# EAGLE board dac8_v2 (EAGLE 5.12)
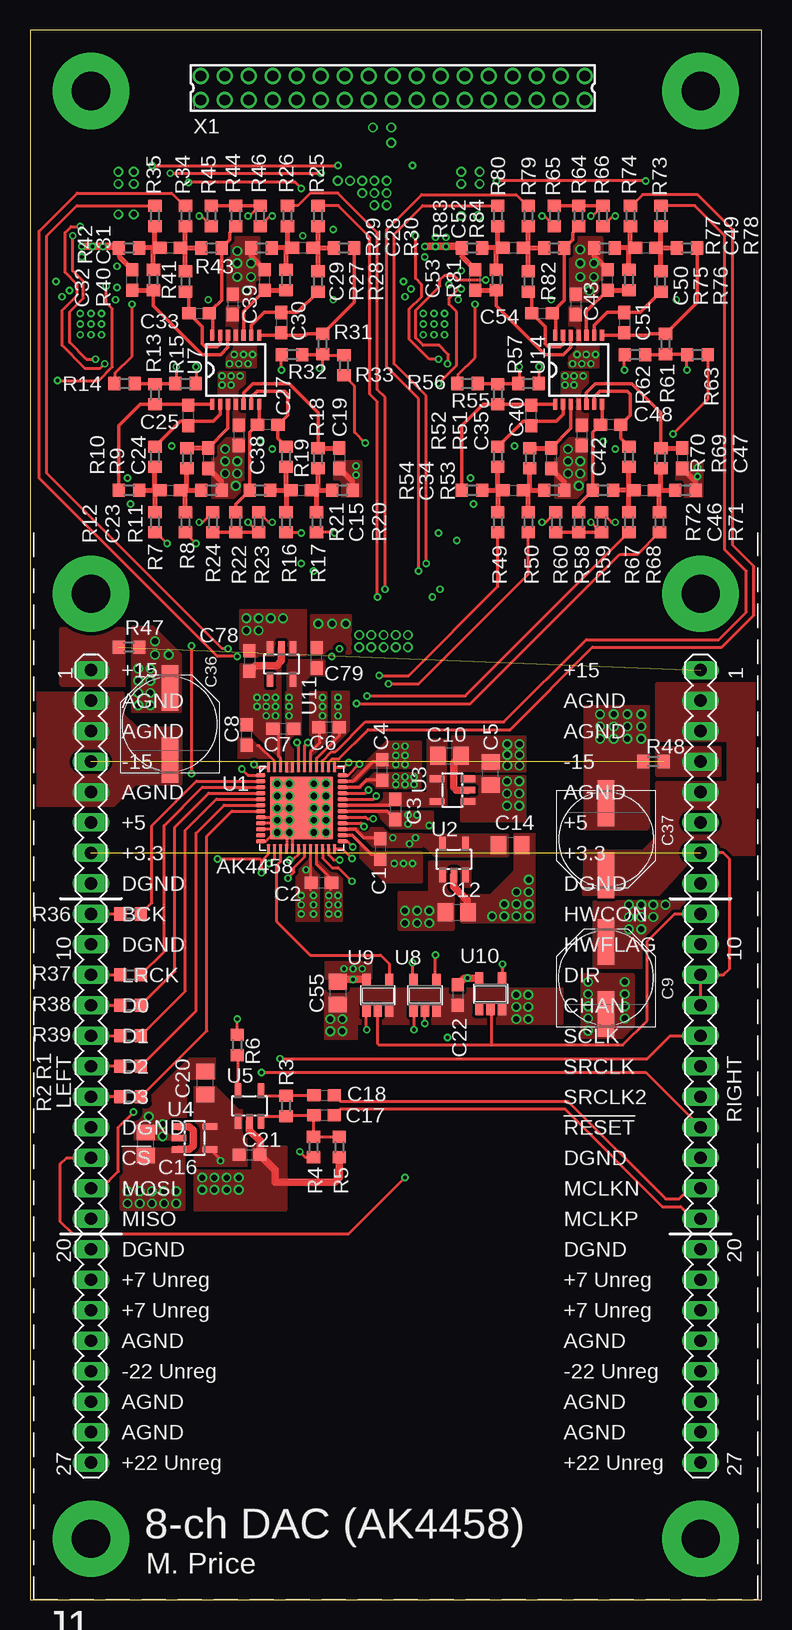
[diagram p2: board, top side]
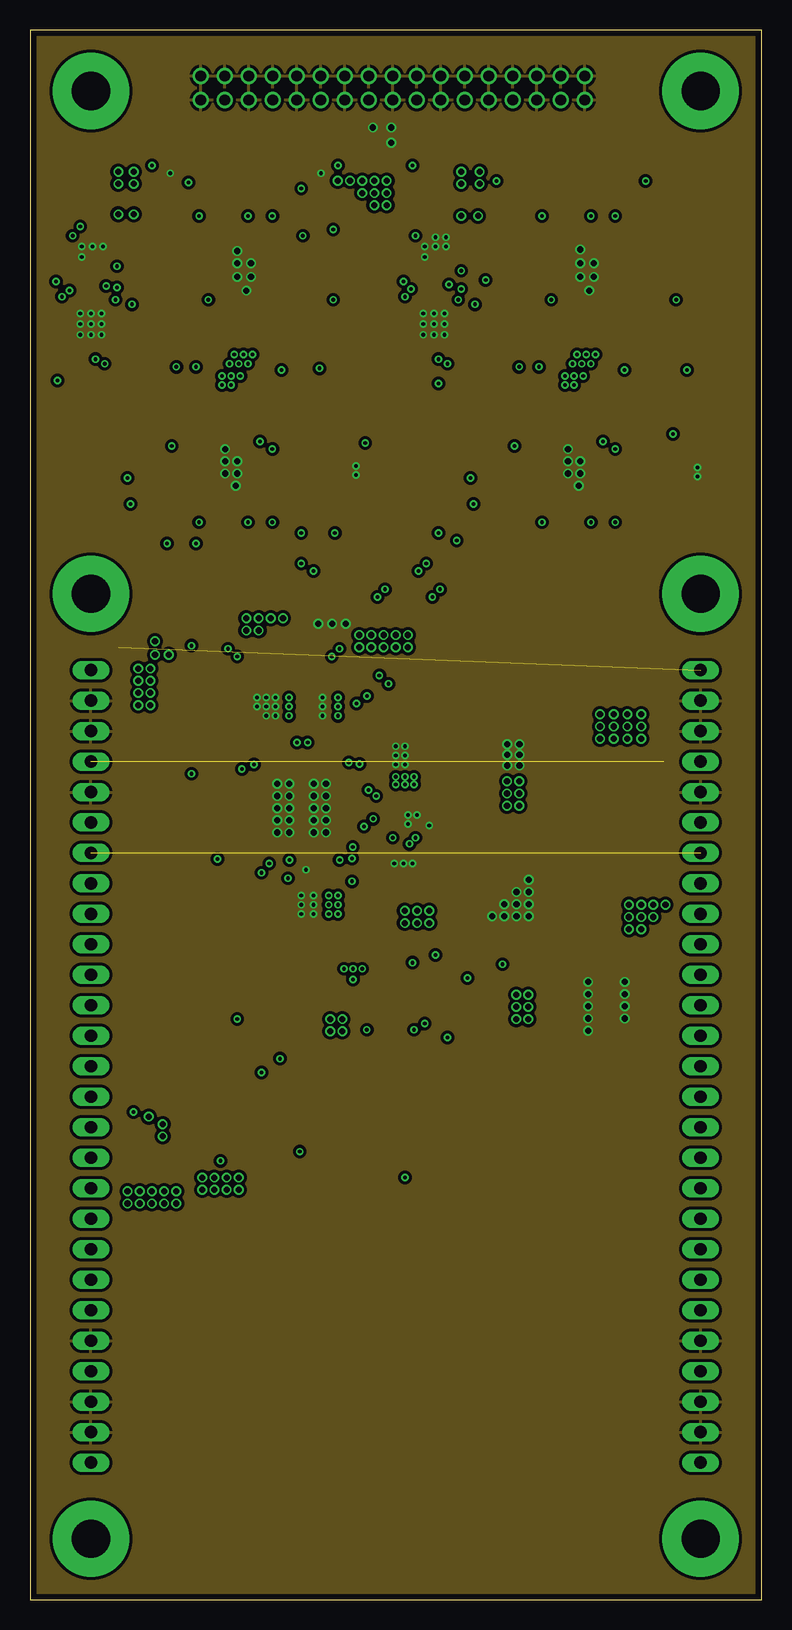
[diagram p3: board, inner layer Route2]
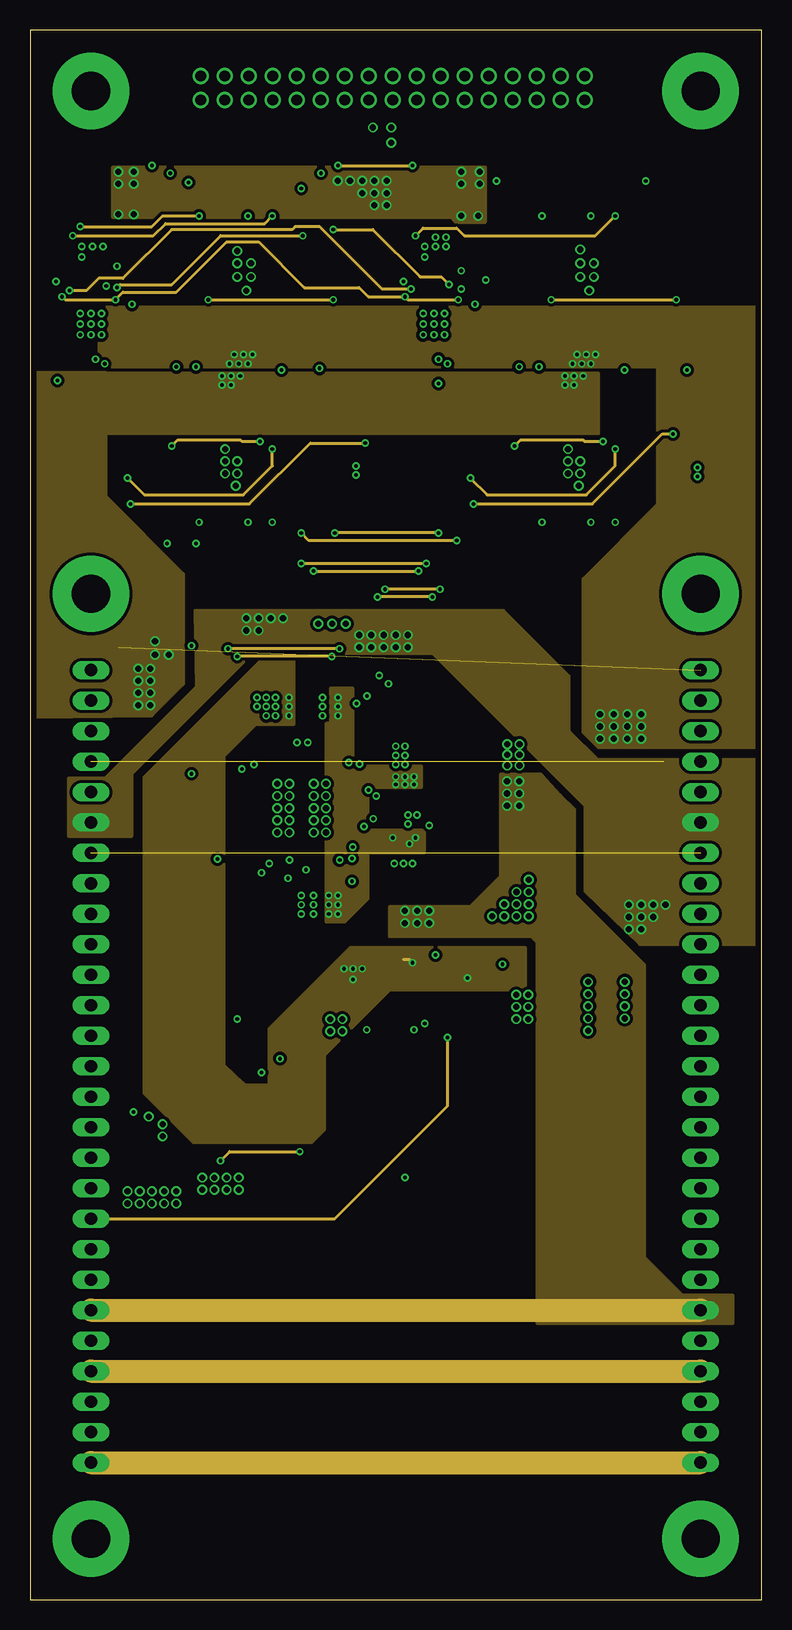
[diagram p4: board, inner layer Route15]
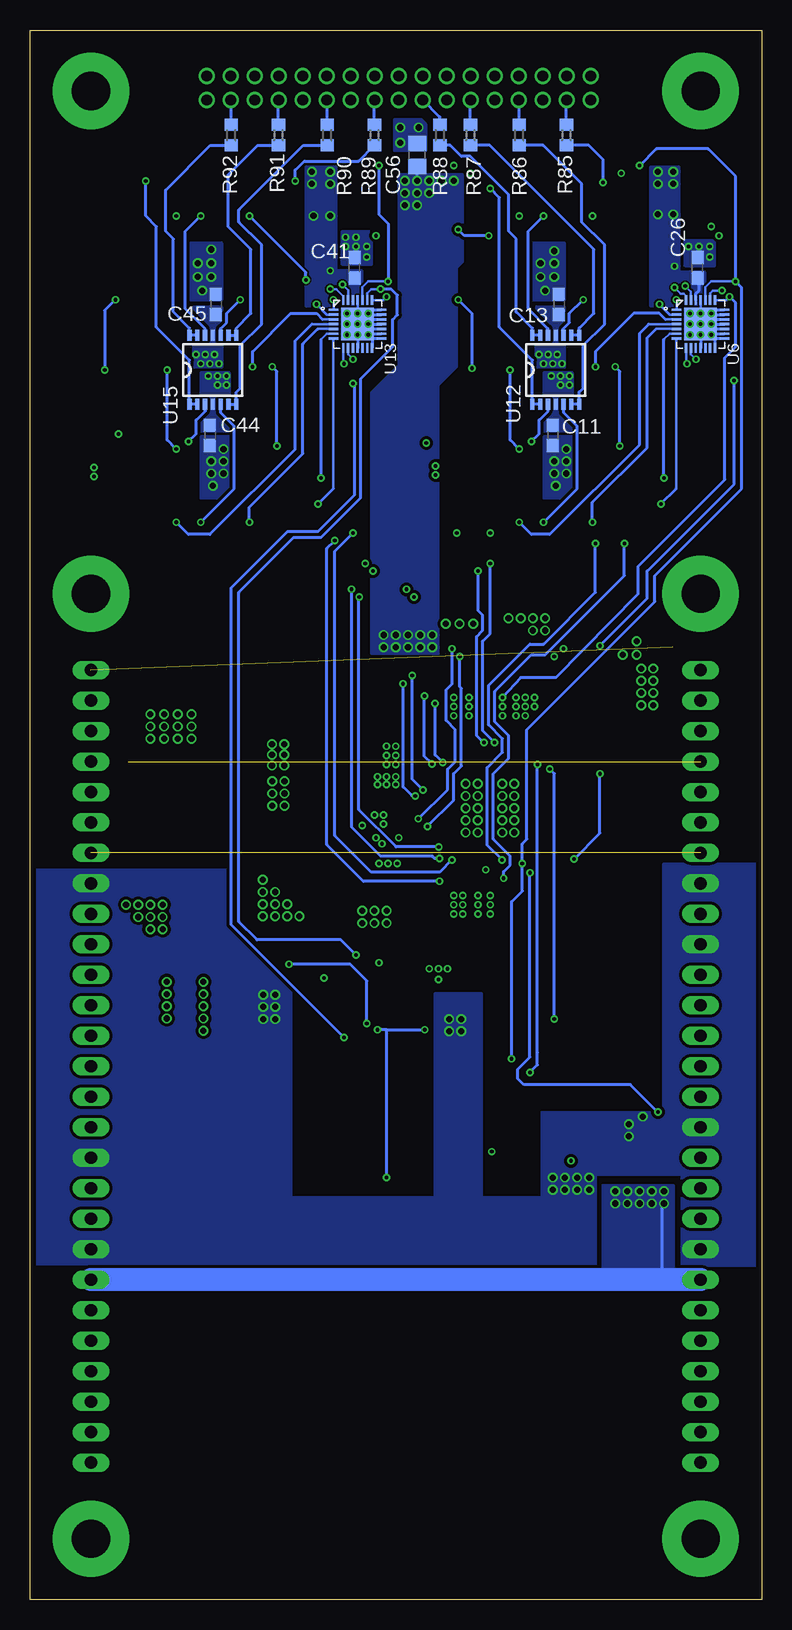
[diagram p5: board, bottom side, seen from below]

Size 60.96 x 130.81 mm. Coordinates in mm from the lower left corner, seen from the top.
Outline: 60.96,130.81 0,130.81 0,0 60.96,0 60.96,130.81
Copper layers (1*2*15*16): Top 0.035mm / dielectric 0.2mm / Route2 0.035mm / dielectric 1.2mm / Route15 0.035mm / dielectric 0.2mm / Bottom 0.035mm
Design rules "Elecrow_4-layer_PCB_eagle_rule": minimum track width 6mil, minimum drill 12mil, track to track 6mil, track to pad 6mil, pad to pad 6mil, via to via 8mil, smd to smd 0mil, copper to edge 20mil, drill to drill 10mil, minimum pad ring 6mil, minimum via ring 6mil, stop-mask expansion 0mil, vias tented up to drill 100mil, thermal gap 10mil

## Footprints (pad centres in the part's own frame; a part is rotated, then mirrored left to right if it is on the bottom)
C0603 = smd 1.1 x 1: 1 -0.85,0; 2 0.85,0
C0805 = smd 1.3 x 1.5: 1 -0.95,0; 2 0.95,0
PANASONIC_E = smd 3.8 x 1.4: + 3,0; - -3,0
MOD-V2 = drill 1.016 long: 1L -25.4,33.02; 1R 25.4,33.02; 2L -25.4,30.48; 2R 25.4,30.48; 3L -25.4,27.94; 3R 25.4,27.94; 4L -25.4,25.4; 4R 25.4,25.4; 5L -25.4,22.86; 5R 25.4,22.86; 6L -25.4,20.32; 6R 25.4,20.32; 7L -25.4,17.78; 7R 25.4,17.78; 8L -25.4,15.24; 8R 25.4,15.24; 9L -25.4,12.7; 9R 25.4,12.7; 10L -25.4,10.16; 10R 25.4,10.16; 11L -25.4,7.62; 11R 25.4,7.62; 12L -25.4,5.08; 12R 25.4,5.08; 13L -25.4,2.54; 13R 25.4,2.54; 14L -25.4,0; 14R 25.4,0; 15L -25.4,-2.54; 15R 25.4,-2.54; 16L -25.4,-5.08; 16R 25.4,-5.08; 17L -25.4,-7.62; 17R 25.4,-7.62; 18L -25.4,-10.16; 18R 25.4,-10.16; 19L -25.4,-12.7; 19R 25.4,-12.7; 20L -25.4,-15.24; 20R 25.4,-15.24; 21L -25.4,-17.78; 21R 25.4,-17.78; 22L -25.4,-20.32; 22R 25.4,-20.32; 23L -25.4,-22.86; 23R 25.4,-22.86; 24L -25.4,-25.4; 24R 25.4,-25.4; 25L -25.4,-27.94; 25R 25.4,-27.94; 26L -25.4,-30.48; 26R 25.4,-30.48; 27L -25.4,-33.02; 27R 25.4,-33.02 | drill 3.175 pad 6.35 round: DP1 -25.4,39.37; DP2 25.4,39.37; DP3 -25.4,-39.37; DP4 25.4,-39.37
R0603 = smd 1 x 1.1: 1 -0.85,0; 2 0.85,0
QFN48_EP_AKM = smd 0.8 x 0.3: 1 -3.4,2.75; 2 -3.4,2.25; 3 -3.4,1.75; 4 -3.4,1.25; 5 -3.4,0.75; 6 -3.4,0.25; 7 -3.4,-0.25; 8 -3.4,-0.75; 9 -3.4,-1.25; 10 -3.4,-1.75; 11 -3.4,-2.25; 12 -3.4,-2.75; 25 3.4,-2.75; 26 3.4,-2.25; 27 3.4,-1.75; 28 3.4,-1.25; 29 3.4,-0.75; 30 3.4,-0.25; 31 3.4,0.25; 32 3.4,0.75; 33 3.4,1.25; 34 3.4,1.75; 35 3.4,2.25; 36 3.4,2.75 | smd 0.3 x 0.8: 13 -2.75,-3.4; 14 -2.25,-3.4; 15 -1.75,-3.4; 16 -1.25,-3.4; 17 -0.75,-3.4; 18 -0.25,-3.4; 19 0.25,-3.4; 20 0.75,-3.4; 21 1.25,-3.4; 22 1.75,-3.4; 23 2.25,-3.4; 24 2.75,-3.4; 37 2.75,3.4; 38 2.25,3.4; 39 1.75,3.4; 40 1.25,3.4; 41 0.75,3.4; 42 0.25,3.4; 43 -0.25,3.4; 44 -0.75,3.4; 45 -1.25,3.4; 46 -1.75,3.4; 47 -2.25,3.4; 48 -2.75,3.4 | smd 5.2 x 5.2: EP 0,0
SOT23-DBV = smd 0.55 x 1.2: 1 -0.95,-1.3; 2 0,-1.3; 3 0.95,-1.3; 4 0.95,1.3; 5 -0.95,1.3
QFN28 = smd 0.2 x 0.8: 1 -1.2,-2; 2 -0.8,-2; 3 -0.4,-2; 4 0,-2; 5 0.4,-2; 6 0.8,-2; 7 1.2,-2; 15 1.2,2; 16 0.8,2; 17 0.4,2; 18 0,2; 19 -0.4,2; 20 -0.8,2; 21 -1.2,2 | smd 0.8 x 0.2: 8 2,-1.2; 9 2,-0.8; 10 2,-0.4; 11 2,0; 12 2,0.4; 13 2,0.8; 14 2,1.2; 22 -2,1.2; 23 -2,0.8; 24 -2,0.4; 25 -2,0; 26 -2,-0.4; 27 -2,-0.8; 28 -2,-1.2 | smd 2.7 x 2.7: EP 0,0
TSSOP14 = smd 0.9 x 0.35: 1 -2.875,1.95; 2 -2.875,1.3; 3 -2.875,0.65; 4 -2.875,0; 5 -2.875,-0.65; 6 -2.875,-1.3; 7 -2.875,-1.95; 8 2.875,-1.95; 9 2.875,-1.3; 10 2.875,-0.65; 11 2.875,0; 12 2.875,0.65; 13 2.875,1.3; 14 2.875,1.95
SOT23-5 = smd 0.69 x 0.99: 1 -0.95,-1.29; 2 0,-1.29; 3 0.95,-1.29; 4 0.95,1.3; 5 -0.95,1.3
87758-3416 = drill 0.9 pad 1.27 round: 1 -16,-1; 2 -16,1; 3 -14,-1; 4 -14,1; 5 -12,-1; 6 -12,1; 7 -10,-1; 8 -10,1; 9 -8,-1; 10 -8,1; 11 -6,-1; 12 -6,1; 13 -4,-1; 14 -4,1; 15 -2,-1; 16 -2,1; 17 0,-1; 18 0,1; 19 2,-1; 20 2,1; 21 4,-1; 22 4,1; 23 6,-1; 24 6,1; 25 8,-1; 26 8,1; 27 10,-1; 28 10,1; 29 12,-1; 30 12,1; 31 14,-1; 32 14,1; 33 16,-1; 34 16,1

## Placement (x,y rotation side)
C1  0.1u  [C0603]  29.18,62.56 270 top
C2  0.1u  [C0603]  24.28,59.74 180 top
C3  0.1u  [C0603]  30.45,65.86 270 top
C4  0.1u  [C0603]  29.36,69.14 90 top
C5  2.2u  [C0805]  38.38,68.86 90 top
C6  0.1u  [C0603]  24.92,72.69 180 top
C7  0.1u  [C0603]  21.11,72.57 180 top
C8  1u  [C0603]  18.06,72.06 90 top
C9  220u  [PANASONIC_E]  48.01,51.82 90 top
C10  2.2u  [C0805]  34.95,70.33 0 top
C11  0.1u  [C0603]  17.4,97.03 270 bottom
C12  2.2u  [C0805]  35.56,57.28 0 top
C13  0.1u  [C0603]  16.89,107.95 270 bottom
C14  2.2u  [C0805]  40.01,62.87 0 top
C15  3.9n  [C0603]  22.61,92.46 0 top
C16  2.2u  [C0805]  9.65,37.97 90 top
C17  10n  [C0603]  24.51,40.39 0 top
C18  10n  [C0603]  24.51,42.04 0 top
C19  470p  [C0603]  25.78,95.12 270 top
C20  2.2u  [C0805]  14.61,43.05 90 top
C21  0.1u  [C0603]  18.29,37.08 0 top
C22  0.1u  [C0603]  35.64,50.39 270 top
C23  3.9n  [C0603]  11.68,92.46 0 top
C24  470p  [C0603]  14.86,95.12 270 top
C25  470p  [C0603]  13.21,98.68 90 top
C26  0.1u  [C0603]  5.33,111 90 bottom
C27  470p  [C0603]  19.81,97.92 180 top
C28  3.9n  [C0603]  22.73,112.65 180 top
C29  470p  [C0603]  19.56,109.98 90 top
C30  470p  [C0603]  20.95,106.43 270 top
C31  3.9n  [C0603]  11.68,112.65 180 top
C32  470p  [C0603]  8.51,109.98 90 top
C33  470p  [C0603]  14.1,107.19 0 top
C34  3.9n  [C0603]  40.26,92.46 0 top
C35  470p  [C0603]  43.43,95.12 270 top
C36  100u  [PANASONIC_E]  11.66,72.97 90 top
C37  100u  [PANASONIC_E]  48.01,63.37 270 top
C38  0.1u  [C0603]  17.4,97.03 270 top
C39  0.1u  [C0603]  16.89,107.95 270 top
C40  470p  [C0603]  41.78,98.68 90 top
C41  0.1u  [C0603]  33.91,111 90 bottom
C42  0.1u  [C0603]  45.97,97.03 270 top
C43  0.1u  [C0603]  45.47,107.95 270 top
C44  0.1u  [C0603]  45.97,97.03 270 bottom
C45  0.1u  [C0603]  45.47,107.95 270 bottom
C46  3.9n  [C0603]  51.18,92.46 0 top
C47  470p  [C0603]  54.36,95.12 270 top
C48  470p  [C0603]  48.39,97.92 180 top
C49  3.9n  [C0603]  51.31,112.65 180 top
C50  470p  [C0603]  48.13,109.98 90 top
C51  470p  [C0603]  49.53,106.43 270 top
C52  3.9n  [C0603]  40.26,112.65 180 top
C53  470p  [C0603]  37.08,109.98 90 top
C54  470p  [C0603]  42.67,107.19 0 top
C55  2.2u  [C0805]  25.65,50.55 270 top
C56  2.2u  [C0805]  28.7,120.4 90 bottom
C78  1u  [C0603]  18.29,78.23 270 top
C79  1u  [C0603]  23.88,78.49 90 top
J1  MOD-V2  [MOD-V2]  30.48,44.45 0 top
R1  50  [R0603]  8.38,44.45 180 top
R2  50  [R0603]  8.38,41.91 180 top
R3  100  [R0603]  21.34,41.15 270 top
R4  10k  [R0603]  23.62,37.72 270 top
R5  10k  [R0603]  25.78,37.72 90 top
R6  22  [R0603]  17.27,46.23 270 top
R7  3.3k  [R0603]  10.41,89.79 270 top
R8  3.3k  [R0603]  12.95,89.79 270 top
R9  150  [R0603]  13.08,95.12 270 top
R10  150  [R0603]  10.41,95.25 90 top
R11  3.3k  [R0603]  15.11,92.46 0 top
R12  3.3k  [R0603]  8.26,92.46 180 top
R13  2k  [R0603]  10.41,100.46 90 top
R14  931  [R0603]  7.87,101.35 0 top
R15  221  [R0603]  12.95,101.35 180 top
R16  3.3k  [R0603]  21.34,89.79 270 top
R17  3.3k  [R0603]  23.88,89.79 270 top
R18  150  [R0603]  24,95.12 270 top
R19  150  [R0603]  21.34,95.25 90 top
R20  3.3k  [R0603]  26.04,92.46 0 top
R21  3.3k  [R0603]  19.18,92.46 180 top
R22  2k  [R0603]  17.14,89.79 270 top
R23  931  [R0603]  19.05,89.79 270 top
R24  221  [R0603]  15.24,89.79 270 top
R25  3.3k  [R0603]  24,115.32 90 top
R26  3.3k  [R0603]  21.46,115.32 90 top
R27  150  [R0603]  21.34,109.98 90 top
R28  150  [R0603]  24,109.86 270 top
R29  3.3k  [R0603]  19.3,112.65 180 top
R30  3.3k  [R0603]  26.16,112.65 0 top
R31  2k  [R0603]  24.38,104.65 270 top
R32  931  [R0603]  21.84,103.76 0 top
R33  221  [R0603]  26.16,102.87 90 top
R34  3.3k  [R0603]  12.95,115.32 90 top
R35  3.3k  [R0603]  10.41,115.32 90 top
R36  50  [R0603]  8.38,57.15 180 top
R37  50  [R0603]  8.38,52.07 180 top
R38  50  [R0603]  8.38,49.53 180 top
R39  50  [R0603]  8.38,46.99 180 top
R40  150  [R0603]  10.29,109.98 90 top
R41  150  [R0603]  12.95,109.86 270 top
R42  3.3k  [R0603]  8.26,112.65 180 top
R43  3.3k  [R0603]  15.11,112.65 0 top
R44  2k  [R0603]  17.14,115.32 90 top
R45  931  [R0603]  15.11,115.32 90 top
R46  221  [R0603]  19.18,115.32 90 top
R47  0  [R0603]  8.26,79.38 180 top
R48  0  [R0603]  51.94,69.85 0 top
R49  3.3k  [R0603]  38.99,89.79 270 top
R50  3.3k  [R0603]  41.53,89.79 270 top
R51  150  [R0603]  41.66,95.12 270 top
R52  150  [R0603]  38.99,95.25 90 top
R53  3.3k  [R0603]  43.69,92.46 0 top
R54  3.3k  [R0603]  36.83,92.46 180 top
R55  2k  [R0603]  38.99,100.46 90 top
R56  931  [R0603]  36.45,101.35 0 top
R57  221  [R0603]  41.53,101.35 180 top
R58  2k  [R0603]  45.72,89.79 270 top
R59  931  [R0603]  47.62,89.79 270 top
R60  221  [R0603]  43.81,89.79 270 top
R61  2k  [R0603]  52.96,104.65 270 top
R62  931  [R0603]  50.42,103.76 0 top
R63  221  [R0603]  55.63,103.76 180 top
R64  2k  [R0603]  45.72,115.32 90 top
R65  931  [R0603]  43.69,115.32 90 top
R66  221  [R0603]  47.75,115.32 90 top
R67  3.3k  [R0603]  49.91,89.79 270 top
R68  3.3k  [R0603]  52.45,89.79 270 top
R69  150  [R0603]  52.58,95.12 270 top
R70  150  [R0603]  49.91,95.25 90 top
R71  3.3k  [R0603]  54.61,92.46 0 top
R72  3.3k  [R0603]  47.75,92.46 180 top
R73  3.3k  [R0603]  52.58,115.32 90 top
R74  3.3k  [R0603]  50.04,115.32 90 top
R75  150  [R0603]  49.91,109.98 90 top
R76  150  [R0603]  52.58,109.86 270 top
R77  3.3k  [R0603]  47.88,112.65 180 top
R78  3.3k  [R0603]  54.74,112.65 0 top
R79  3.3k  [R0603]  41.53,115.32 90 top
R80  3.3k  [R0603]  38.99,115.32 90 top
R81  150  [R0603]  38.86,109.98 90 top
R82  150  [R0603]  41.53,109.86 270 top
R83  3.3k  [R0603]  36.83,112.65 180 top
R84  3.3k  [R0603]  43.69,112.65 0 top
R85  50  [R0603]  16.26,122.05 90 bottom
R86  50  [R0603]  20.19,122.05 90 bottom
R87  50  [R0603]  24.26,122.05 90 bottom
R88  50  [R0603]  26.8,122.05 90 bottom
R89  50  [R0603]  32.26,122.05 90 bottom
R90  50  [R0603]  36.2,122.05 90 bottom
R91  50  [R0603]  40.26,122.05 90 bottom
R92  50  [R0603]  44.2,122.05 90 bottom
U1  AK4458  [QFN48_EP_AKM]  22.63,65.96 0 top
U2  ADP7118AUJZ-5.0  [SOT23-DBV]  35.33,61.7 0 top
U3  ADP7118AUJZ-5.0  [SOT23-DBV]  35.2,67.46 90 top
U4  ADP7118AUJZ-3.3  [SOT23-DBV]  13.72,38.48 270 top
U5  DS90LV012  [SOT23-DBV]  18.29,41.15 0 top
U6  MAX14662  [QFN28]  5.08,106.3 270 bottom
U7  OPA1664PW  [TSSOP14]  17.14,102.49 90 top
U8  74AHC1G32DBV  [SOT23-5]  32.92,50.37 0 top
U9  74AHC1G32DBV  [SOT23-5]  28.98,50.37 0 top
U10  74AHC1G04DBV  [SOT23-5]  38.38,50.5 0 top
U11  ADM7160  [SOT23-DBV]  20.95,77.98 180 top
U12  OPA1664PW  [TSSOP14]  17.14,102.49 90 bottom
U13  MAX14662  [QFN28]  33.66,106.3 270 bottom
U14  OPA1664PW  [TSSOP14]  45.72,102.49 90 top
U15  OPA1664PW  [TSSOP14]  45.72,102.49 90 bottom
X1  87758-3416  [87758-3416]  30.23,125.98 0 top

## Tracks (layer width: path | path; a pad name or v marks a point on that pad's centre or on a via)
!CS  (via drill 0.3 pad 0.51)
  Top 0.254: J1.17L 3.05,36.83 2.54,36.32 2.54,31.5 3.56,30.48 26.54,30.48 v31.24,35.18 | v28.07,47.5 28.03,47.53 U9.1 | U8.1 32,49.04 v32,47.5
  Bottom 0.254: v31.24,35.18 31.24,47.5 | 31.24,47.5 v28.07,47.5 | 31.24,47.5 v32,47.5
!CS_ATTEN  (via drill 0.3 pad 0.51)
  Top 0.254: U8.4 33.78,51.76 v33.78,53.72
  Route15 0.254: v31.75,109.22 29.34,109.22 24.13,114.43 22.1,114.43 21.84,114.17 11.81,114.17 7.75,110.11 5.71,110.11 4.7,109.09 v3.3,109.09
  Bottom 0.203: U6.23 4.28,108.88 4.06,109.09 v3.3,109.09 | U13.23 32.85,108.88 32.51,109.22 v31.75,109.22
  Bottom 0.254: v33.78,53.72 35.05,54.99 42.04,54.99 43.56,56.52 43.56,83.95 38.99,88.52 36.7,88.52 33.4,91.82 33.4,101.73 30.73,104.39 30.73,106.68 30.35,107.06 30.35,108.71 30.86,109.22 v31.75,109.22
!CS_DAC
  Top 0.254: U9.4 29.93,53 29.21,53.72 23.37,53.72 20.57,56.52 20.57,61.21 20.88,61.52 U1.15
!RESET  (via drill 0.3 pad 0.51)
  Top 0.254: J1.16R 51.31,43.94 v19.3,43.94 | v18.67,69.6 18.9,69.36 U1.48
  Bottom 0.254: v19.3,43.94 18.67,44.58 18.67,45.59 v18.67,69.6
A5V  (via drill 0.3 pad 0.51, 0.51 pad 0.81)
  Bottom 0.254: v28.7,118.24 C56.1 | 5.48,110 C26.1 5.21,110.02 5.21,109.09 5.48,108.82 U6.26
  other vias: 7.24,111.12 35.94,110.74 18.03,81.79 19.05,81.79 20.07,81.79 21.08,81.79 18.03,80.77 19.05,80.77 49.91,57.91 50.93,57.91 51.94,57.91 52.96,57.91 50.93,56.9 51.94,56.9 49.91,56.9 49.91,55.88 50.93,55.88 7.37,119 8.64,119 7.37,117.98 8.64,117.98 7.37,115.44 8.64,115.44 35.94,119 37.47,119 35.94,117.98 37.47,117.98 35.94,115.32 37.34,115.32 29.72,118.24 27.43,79.38 28.45,79.38 29.46,79.38 30.48,79.38 31.5,79.38 27.43,80.39 28.45,80.39 29.46,80.39 30.48,80.39 31.5,80.39 27.69,118.24 26.67,118.24 25.65,118.24 29.72,117.22 28.7,117.22 27.69,117.22 29.72,116.2 28.7,116.2
  pour Bottom (isolate 0.152, no thermals): 4.7,110.62 6.86,110.62 6.86,119.38 9.27,119.38 9.27,107.82 4.7,107.82
  pour Bottom (isolate 0.152, no thermals): 33.27,110.74 35.43,110.74 35.43,119.38 37.97,119.38 37.97,107.82 33.27,107.82
  pour Top (isolate 0.254, no thermals): 17.53,78.61 18.92,78.61 19.05,78.74 22.99,78.74 22.99,82.42 17.53,82.42
  pour Route15 (isolate 0.254, no thermals): 19.05,78.87 33.53,78.87 46.23,66.17 46.23,59.05 50.8,54.61 60.83,54.61 60.83,69.98 47.37,69.98 44.96,72.39 44.96,76.96 39.5,82.42 19.05,82.42
  pour Top (isolate 0.254, no thermals): 46.99,52.7 54.61,52.7 54.61,58.17 46.99,58.17
  pour Route15 (isolate 0.254, no thermals): 3.17,63.63 8.51,63.63 8.51,68.83 18.54,78.87 19.68,78.87 19.68,82.42 13.72,82.42 13.84,76.07 6.22,68.45 3.17,68.45
  pour Route15 (isolate 0.254, no thermals): 6.86,119.38 6.86,115.19 35.05,115.19 35.43,114.81 37.97,114.81 37.97,119.38
  pour Bottom (isolate 0.254, no thermals): 24.89,118.75 30.23,118.75 30.23,102.87 32.51,100.58 32.51,78.87 26.92,78.87 26.92,101.22 25.4,102.74 25.4,111 24.89,111.51
A5VDAC
  Top 0.305: U1.31 29.96,66.21 C3.1
  pour Top (isolate 0.254, no thermals): 26.67,66.19 32.64,66.19 32.64,67.16 28.8,67.16 28.07,66.42 26.67,66.42
  pour Top (isolate 0.254, no thermals): 33.15,71.63 33.15,67.18 32.64,67.18 32.64,66.17 34.67,66.17 34.67,71.63
A5VREF  (via drill 0.3 pad 0.51)
  Top 0.254: U1.21 23.88,61.28 25.04,60.12 25.04,59.19 | U1.40 23.88,70.14 25.81,72.06 25.81,73.11 C6.1
  Top 0.305: U1.34 27.45,67.71 28.07,68.33 29.07,68.33 C4.1 | U1.27 27.1,64.21 27.81,63.5 29.09,63.5 C1.1
  other vias: 25.65,75.18 25.65,74.42 25.65,73.66 30.48,68.58 32,68.58 32,67.94 30.48,67.94 30.23,63.5 31.62,62.99 32.13,63.5 24.89,57.91 25.65,57.91 24.89,57.15 31.24,68.58 31.24,67.94 24.89,58.67 25.65,58.67 25.65,57.15
  pour Top (isolate 0.254, no thermals): 24.66,56.57 24.66,60.5 24.03,61.14 24.03,61.77 24.28,61.77 25.93,60.12 25.93,56.57
  pour Top (isolate 0.254, no thermals): 25.17,75.62 25.17,71.3 24.28,70.41 24.28,70.15 26.57,72.44 26.57,75.62
  pour Top (isolate 0.254, no thermals): 26.92,67.56 27.81,67.56 27.97,67.72 32.51,67.72 32.51,68.83 28.7,68.83 27.56,67.69 26.92,67.69
  pour Top (isolate 0.152, no thermals): 26.67,64.26 29.34,64.26 29.84,63.75 32.64,63.75 32.64,62.79 28.65,62.79 27.25,64.19 26.67,64.19
  pour Top (isolate 0.254, no thermals): 32.51,63.75 39.75,63.75 39.75,61.98 33.78,61.98 33.02,62.74 32.89,62.87 32.51,62.87
  pour Route15 (isolate 0.254, no thermals): 25.02,73.03 24.64,73.03 24.64,56.52 26.29,56.52 28.19,58.42 28.19,69.47 26.92,69.47 26.92,75.95 25.02,75.95
  pour Route15 (isolate 0.254, no thermals): 27.18,62.23 32.89,62.23 32.89,64.14 27.18,64.14
  pour Route15 (isolate 0.254, no thermals): 32.64,69.47 27.56,69.47 27.56,67.69 32.64,67.69
A7VU  (via drill 0.51 pad 0.81)
  Route15 1.93: J1.22L J1.22R
  other vias: 39.75,68.2 40.77,68.2 39.75,67.18 40.77,67.18 39.75,66.17 40.77,66.17 31.24,56.39 32.26,56.39 33.27,56.39 31.24,57.4 32.26,57.4 33.27,57.4
  pour Top (isolate 0.254, no thermals): 35.94,68.58 35.94,64.9 41.27,64.9 41.27,68.58
  pour Top (isolate 0.254, no thermals): 36.58,61.47 33.27,61.47 33.27,58.93 30.73,58.93 30.73,55.88 35.31,55.88 35.31,59.44 36.7,59.44 36.7,61.34
  pour Route15 (isolate 0.254, no thermals): 58.55,22.99 42.29,22.99 42.29,54.74 41.78,55.24 29.97,55.24 29.97,57.78 36.7,57.78 39.24,60.33 39.24,68.83 42.55,68.83 44.2,67.06 45.34,65.91 45.34,58.8 51.18,52.96 51.18,28.57 54.36,25.4 58.55,25.4
AGND  (via drill 0.3 pad 0.51, 0.51 pad 0.81)
  Top 0.254: 23.38,59.16 U1.20 | U1.41 23.38,70.65 24.16,71.42 24.16,73.16 C6.2 | U1.46 20.88,70.13 20.73,70.28 20.73,72.61 C7.2 | U1.8 20.33,65.21 v20.6,64.95 20.36,64.71 U1.9 | U1.10 20.32,64.21 v20.6,63.93 20.22,63.55 19.99,63.55 19.65,63.21 U1.12 | U1.16 21.38,63.7 v21.61,63.93 21.88,63.67 U1.17 | v11.68,118.87 v24.26,118.87
  Top 0.305: U1.35 26.94,68.21 28.57,69.85 29.22,69.85 C4.2 | U1.30 29.75,65.71 C3.2 | U1.26 26.84,63.71 28.45,62.1 28.79,62.1 C1.2
  Top 0.406: C24.2 15.96,93.17 R11.2 | C19.2 26.89,93.17 R20.2 | C29.2 18.45,111.94 R29.2 | C32.2 7.44,111.93 R42.2 | C35.2 44.54,93.17 R53.2 | C47.2 55.46,93.17 R71.2 | C50.2 47.03,111.94 R77.2 | C53.2 36.02,111.93 R83.2
  Top 0.61: U3.2 35.53,67.46 35.31,67.69 35.31,69.74 C10.2 | U11.2 20.95,78.23 20.57,77.85 18.76,77.85 C78.2 | U2.2 35.33,59.41 36.45,58.29 36.45,57.34 C12.2 | R42.2 7.28,112.78 v4.32,112.78 | R83.2 35.85,112.78 v32.89,112.78
  Bottom 0.203: U6.EP U6.25 | U13.EP U13.25
  Bottom 0.254: U6.21 3.88,107.5 v4.19,107.19 4.28,107.1 | 4.28,107.1 U6.20 | U6.EP 4.57,106.81 | 4.57,106.81 4.28,107.1 | U6.19 4.46,106.7 4.57,106.81 | U6.EP U6.18 | U6.17 5.32,105.9 5.33,105.92 5.33,106.05 U6.EP | 3.94,105.5 4.28,105.5 U6.EP | 3.94,105.5 U6.16 | U6.15 3.88,105.1 U6.EP | U6.14 3.88,105.44 3.94,105.5 | U6.EP U6.11 | U13.21 32.45,107.5 v32.77,107.19 32.85,107.1 | 32.85,107.1 U13.20 | U13.EP 33.15,106.81 | 33.15,106.81 32.85,107.1 | U13.19 33.04,106.7 33.15,106.81 | U13.EP U13.18 | U13.17 33.89,105.9 33.91,105.92 33.91,106.05 U13.EP | 32.51,105.5 32.85,105.5 U13.EP | 32.51,105.5 U13.16 | U13.15 32.45,105.1 U13.EP | U13.14 32.45,105.44 32.51,105.5 | U13.EP U13.11
  other vias: 18.41,111.38 17.27,111.38 17.27,110.24 18.41,110.24 18.03,109.09 17.27,112.39 16.26,95.89 16.26,94.87 17.27,94.87 17.27,93.85 16.26,93.85 17.14,92.84 5.08,107.19 5.97,107.19 4.19,106.3 5.08,106.3 5.97,106.3 5.97,105.41 5.08,105.41 4.19,105.41 4.32,111.89 5.21,112.78 6.1,112.78 46.99,111.38 45.85,111.38 45.85,110.24 46.99,110.24 46.61,109.09 45.85,112.52 44.83,95.89 44.83,94.87 45.85,94.87 45.85,93.85 44.83,93.85 45.72,92.84 33.66,107.19 34.54,107.19 32.77,106.3 33.66,106.3 34.54,106.3 34.54,105.41 33.66,105.41 32.77,105.41 32.89,111.89 33.78,112.78 34.67,112.78 21.62,68 20.6,68 20.6,66.98 20.6,65.96 21.62,66.98 21.62,65.96 23.65,63.93 24.66,63.93 24.66,64.95 24.66,65.96 24.66,66.98 24.66,68 23.65,68 23.65,66.98 23.65,65.96 23.65,64.95 21.62,64.95 20.45,73.66 19.68,73.66 20.45,74.42 19.68,74.42 18.92,74.42 20.45,75.18 19.68,75.18 18.92,75.18 24.38,75.18 24.38,74.42 24.38,73.66 30.48,71.12 30.48,70.36 30.48,69.6 39.78,71.3 40.79,71.3 39.78,70.41 40.79,70.41 39.78,69.52 40.79,69.52 31.5,64.64 32.26,65.41 33.27,64.52 30.35,61.34 31.11,61.34 31.88,61.34 22.99,60.83 23.62,57.91 22.61,57.91 22.61,57.15 24.03,81.33 25.17,81.33 26.31,81.33 38.51,56.95 39.52,56.95 40.54,56.95 41.55,56.95 41.55,57.96 40.54,57.96 40.54,58.98 41.55,58.98 41.55,59.99 39.52,57.96 27.18,94.49 27.18,93.73 55.63,94.36 55.63,93.6 46.51,47.42 46.51,48.44 46.51,49.45 46.51,50.47 46.51,51.49 49.56,51.49 49.56,50.47 49.56,49.45 49.56,48.44 28.57,122.68 30.1,122.68 30.1,121.41 34.67,113.54 33.78,113.54 31.24,71.12 31.24,70.36 31.24,69.6 31.5,65.41 22.61,58.67 23.62,58.67 23.62,57.15
  pour Route2 (isolate 0.254): 0,0 60.96,0 60.96,161.29 0,161.29
  pour Top (isolate 0.254, no thermals): 15.24,91.82 15.24,96.77 17.91,96.77 17.91,91.82
  pour Top (isolate 0.254, no thermals): 16.38,108.2 16.38,113.54 19.05,113.54 19.05,108.2
  pour Bottom (isolate 0.254, no thermals): 16.38,113.03 19.05,113.03 19.05,108.33 16.38,108.33
  pour Bottom (isolate 0.254, no thermals): 14.86,96.9 18.16,96.9 18.16,91.82 14.86,91.82
  pour Bottom (isolate 0.254, no thermals): 6.35,111.12 6.35,113.28 3.94,113.28 3.94,111.12
  pour Bottom (isolate 0.254, no thermals): 34.92,111.25 34.92,114.05 32.51,114.05 32.51,111.25
  pour Top (isolate 0.254, no thermals): 43.81,91.82 43.81,96.77 46.48,96.77 46.48,91.82
  pour Top (isolate 0.254, no thermals): 44.96,108.2 44.96,113.54 47.62,113.54 47.62,108.2
  pour Bottom (isolate 0.254, no thermals): 44.96,113.03 47.62,113.03 47.62,108.33 44.96,108.33
  pour Bottom (isolate 0.254, no thermals): 43.43,96.9 46.74,96.9 46.74,91.82 43.43,91.82
  pour Top (isolate 0.254, no thermals): 23.52,61.9 23.52,60.88 24.03,60.38 24.03,56.57 22.25,56.57 22.25,60.63
  pour Top (isolate 0.254, no thermals): 17.55,77.9 17.55,72.44 18.49,72.44 18.8,72.14 20.85,70.15 20.85,77.9
  pour Top (isolate 0.254, no thermals): 23.39,75.62 24.66,75.62 24.66,71.55 23.39,70.28
  pour Top (isolate 0.254, no thermals): 20.22,68.38 25.04,68.38 25.04,63.55 20.22,63.55
  pour Top (isolate 0.152, no thermals): 32.51,69.34 28.32,69.34 27.18,68.2 26.92,68.2 26.92,68.71 29.72,71.5 32.51,71.5
  pour Top (isolate 0.254, no thermals): 26.67,65.63 26.67,65.53 28.88,65.53 30.1,64.31 33.53,64.31 33.53,65.63
  pour Top (isolate 0.254, no thermals): 27.56,62.87 27.56,61.85 29.59,59.82 32.64,59.82 32.64,62.23 28.3,62.23
  pour Top (isolate 0.254, no thermals): 35.18,71.88 35.18,69.09 41.27,69.09 41.27,71.88
  pour Top (isolate 0.254, no thermals): 23.5,78.87 23.5,82.04 26.67,82.04 26.67,78.87
  pour Top (isolate 0.254, no thermals): 40.39,63.75 40.39,60.71 38.35,58.67 35.94,58.67 35.94,56.52 42.04,56.52 42.04,63.75
  pour Top (isolate 0.254, no thermals): 12.57,67.94 8.76,67.94 6.99,66.17 0.13,66.17 0.13,75.56 7.75,75.56 7.75,73.79 8.89,72.64 12.57,72.64
  pour Top (isolate 0.254, no thermals): 46.23,62.36 46.1,58.8 52.45,58.8 55.5,62.1 60.83,62.1 60.83,76.33 52.2,76.33 52.2,71.63 58.17,71.63 58.17,68.07 52.2,68.07 52.2,63.5 51.05,62.36
  pour Top (isolate 0.254, no thermals): 25.4,94.87 27.56,94.87 27.56,91.95 25.4,91.95
  pour Top (isolate 0.254, no thermals): 53.85,94.74 53.85,91.95 56.01,91.95 56.01,94.74
  pour Top (isolate 0.254, no thermals): 45.97,46.86 50.29,46.86 50.29,52.07 45.97,52.07
  pour Bottom (isolate 0.254, no thermals): 27.94,120.78 27.94,122.94 28.32,123.32 30.61,123.32 30.61,120.9 30.61,120.78
AN15V  (1 unrouted)
  pour Top (isolate 0.254, no thermals): 52.2,70.99 52.2,68.71 57.53,68.71 57.53,70.99
AN22VU
  Route15 1.93: J1.24L J1.24R
AOUTL1N  (via drill 0.3 pad 0.51)
  Top 0.254: U1.19 22.88,61.9 22,61.01 22,60.63 v21.49,60.12 | R7.2 10.5,88.94 v11.43,88.01
  Bottom 0.254: v11.43,88.01 11.43,85.34 18.03,78.74 19.18,78.74 22.23,75.69 22.23,73.15 21.08,72.01 21.08,70.1 22.35,68.83 22.35,63.37 20.95,61.98 20.95,61.21 21.49,60.68 v21.49,60.12
AOUTL1P  (via drill 0.3 pad 0.51)
  Top 0.254: U1.18 22.38,62.13 21.89,61.65 v21.61,61.65 | R8.2 12.95,88.9 v13.84,88.01
  Bottom 0.254: v13.84,88.01 13.84,83.95 18.16,79.63 19.3,79.63 22.73,76.2 22.73,72.9 21.59,71.75 21.59,70.61 22.86,69.34 22.86,62.89 v21.61,61.65
AOUTL1SE
  Top 0.305: R13.1 13.34,99.61 | 13.34,99.61 U7.1 | R12.2 7.41,97.83 9.19,99.61 R13.1 | C25.2 13.21,99.74 13.34,99.61 | R13.1
AOUTL1SE1
  Top 0.305: R55.1 41.91,99.61 | 41.91,99.61 U14.1 | R54.2 35.98,97.83 37.77,99.61 R55.1 | C40.2 41.78,99.74 41.91,99.61 | R55.1
AOUTL1SE2
  Top 0.305: U14.7 47.67,97.96 47.5,97.79 47.5,97.88 C48.2 46.9,97.28 R72.2 45.72,91.27 R58.1
AOUTL1SE3
  Top 0.305: 49.53,105.36 51.56,105.36 51.7,105.5 R61.1 55.59,108.12 R78.2 | U14.8 49.53,105.36 | 49.53,105.36 C51.2
AOUTL1SE4
  Top 0.305: U7.7 19.09,97.96 18.92,97.79 18.92,97.88 C27.2 18.33,97.28 R21.2 17.14,91.27 R22.1
AOUTL1SE5
  Top 0.305: 20.95,105.36 22.99,105.36 23.12,105.5 R31.1 27.01,108.12 R30.2 | U7.8 20.95,105.36 | 20.95,105.36 C30.2
AOUTL1SE6
  Top 0.254: C33.2 15.07,107.31 15.24,107.31
  Top 0.305: U7.14 15.24,105.41 15.24,107.31 15.24,107.57 15.96,108.29 R43.2 16.64,113.32 16.64,113.92 17.14,114.43 R44.1
AOUTL1SE7
  Top 0.254: C54.2 43.65,107.31 43.81,107.31
  Top 0.305: U14.14 43.81,105.41 43.81,107.31 43.81,107.57 44.54,108.29 R84.2 45.21,113.32 45.21,113.92 45.72,114.43 R64.1
AOUTL2N  (via drill 0.3 pad 0.51)
  Top 0.254: R25.2 25.69,116.17 28.32,113.54 28.32,100.46 28.96,99.82 v28.96,83.57 | U1.25 26.42,63.21 v26.9,62.74
  Route15 0.254: v33.53,83.57 v28.96,83.57
  Bottom 0.254: v26.9,62.74 30.45,62.74 33.55,65.84 33.55,83.54 v33.53,83.57
AOUTL2P  (via drill 0.3 pad 0.51)
  Top 0.254: R26.2 22.31,116.17 23.37,117.22 25.65,117.22 28.96,113.92 28.96,100.84 29.59,100.2 v29.59,84.2 | U1.24 26.03,62.56 v26.82,61.77
  Route15 0.254: v34.16,84.2 v29.59,84.2
  Bottom 0.254: v26.82,61.77 27.23,61.77 27.43,61.98 31.75,61.98 34.16,64.39 v34.16,84.2
AOUTL3N  (via drill 0.3 pad 0.51)
  Top 0.254: U1.33 27.95,67.21 v28.22,67.49 | R49.2 38.99,84.45 31.55,77.01 v29.11,77.01
  Bottom 0.254: v28.22,67.49 29.11,68.38 29.11,76.07 v29.11,77.01
AOUTL3P  (via drill 0.3 pad 0.51)
  Top 0.254: U1.32 28.61,66.71 v28.85,66.98 | R50.2 41.53,85.47 32.38,76.33 v29.87,76.33
  Bottom 0.254: v28.85,66.98 29.11,66.98 29.87,67.74 v29.87,76.33
AOUTL4N
  Top 0.254: R73.2 55.41,116.17 57.91,113.67 57.91,87.5 59.69,85.72 59.69,82.3 57.4,80.01 46.35,80.01 39.5,73.15 27.94,73.15 25.55,70.76 25.43,70.66 25.12,70.66 24.38,69.92 U1.39
AOUTL4P
  Top 0.254: R74.2 50.13,116.17 51.05,117.09 55.63,117.09 58.55,114.17 58.55,87.88 60.33,86.11 60.33,82.04 57.66,79.38 46.86,79.38 40.01,72.52 28.17,72.52 25.73,70.08 25.17,70.08 24.88,69.79 U1.38
AOUTR1N  (via drill 0.3 pad 0.51)
  Top 0.254: U1.22 24.38,61.8 25.17,61.01 25.68,61.01 v26.82,59.87 | v22.61,88.9 21.38,88.9 R16.2
  Route15 0.254: v35.56,88.27 23.24,88.27 v22.61,88.9
  Bottom 0.254: v26.82,59.87 33.17,59.87 36.22,62.92 36.22,87.61 v35.56,88.27
AOUTR1P  (via drill 0.3 pad 0.51)
  Top 0.254: U1.23 24.88,62.06 25.3,61.65 v25.81,61.65 | R17.2 25.36,88.94 v25.4,88.9
  Route15 0.254: v34.04,88.9 v25.4,88.9
  Bottom 0.254: v25.81,61.65 26.82,60.63 32.51,60.63 35.56,63.68 35.56,87.38 v34.04,88.9
AOUTR2N  (via drill 0.3 pad 0.51)
  Top 0.254: R34.2 12.87,116.17 11.81,117.22 3.94,117.22 0.76,114.05 0.76,93.47 15.62,78.61 v17.27,78.61 | U1.28 27.56,64.71 v27.84,64.44
  Route15 0.254: v25.15,78.61 v17.27,78.61
  Bottom 0.254: v25.15,78.61 25.15,76.07 25.02,75.95 25.02,69.47 25.65,68.83 25.65,66.62 v27.84,64.44
AOUTR2P  (via drill 0.3 pad 0.51)
  Top 0.254: R35.2 3.9,116.17 1.4,113.67 1.4,93.85 16,79.25 v16.51,79.25 | U1.29 27.98,65.21 28.12,65.08 v28.6,65.08
  Route15 0.254: v25.78,79.25 v16.51,79.25
  Bottom 0.254: v25.78,79.25 25.78,76.33 26.29,75.82 26.29,73.28 25.53,72.52 25.53,69.85 26.16,69.22 26.16,67.51 v28.6,65.08
AOUTR3N  (via drill 0.3 pad 0.51)
  Top 0.254: U1.36 26.52,68.71 v27.46,69.65 | R67.2 36.28,75.31 v28.09,75.31
  Bottom 0.254: v27.46,69.65 28.09,70.28 v28.09,75.31
AOUTR3P  (via drill 0.3 pad 0.51)
  Top 0.254: U1.37 26.16,69.36 v26.57,69.77 | R68.2 50.63,87.12 49.15,87.12 36.7,74.68 v27.2,74.68
  Bottom 0.254: v26.57,69.77 27.2,70.41 v27.2,74.68 27.2,74.73
AOUTR4N  (via drill 0.3 pad 0.51)
  Top 0.254: R79.2 41.44,116.17 40.51,117.09 32.64,117.09 29.72,114.17 29.72,102.74 32.38,100.08 v32.38,85.72 | U1.42 22.88,71.17 v23.14,71.42
  Route15 0.254: v23.62,85.72 v32.38,85.72
  Bottom 0.254: v23.14,71.42 23.14,71.4 23.75,72.01 23.75,80.26 23.24,80.77 23.24,82.04 23.62,82.42 v23.62,85.72
AOUTR4P  (via drill 0.3 pad 0.51)
  Top 0.254: R80.2 32.73,116.17 30.35,113.79 30.35,103 33.02,100.33 v33.02,86.36 | U1.43 22.38,71.29 v22.25,71.42
  Route15 0.254: v22.61,86.36 v33.02,86.36
  Bottom 0.254: v22.61,86.36 22.61,80.52 23.24,79.88 23.24,72.42 v22.25,71.42
AP15V  (1 unrouted)
  pour Top (isolate 0.254, no thermals): 2.54,80.9 2.54,76.33 2.67,76.2 7.87,76.2 7.87,80.9
AP22VU
  Route15 1.93: J1.27L J1.27R
ATT1LA  (via drill 0.3 pad 0.51)
  Top 0.254: R14.1 7.11,101.43 7.11,102.23 8.51,103.63 v8.51,107.95
  Bottom 0.203: 7.66,107.1 U6.2
  Bottom 0.254: v8.51,107.95 7.66,107.1
ATT1LB  (via drill 0.3 pad 0.51)
  Top 0.254: R15.1 13.84,101.39 v13.84,102.74
  Bottom 0.203: U6.3 8.02,106.7
  Bottom 0.254: 8.02,106.7 8.51,107.19 10.67,107.19 13.84,104.01 v13.84,102.74
ATT1RA  (via drill 0.3 pad 0.51)
  Top 0.254: R23.1 19.9,89.79 v20.19,89.79
  Bottom 0.203: 9.4,106.3 U6.4
  Bottom 0.254: v20.19,89.79 19.18,88.77 17.65,88.77 10.16,96.27 10.16,105.54 9.4,106.3
ATT1RB  (via drill 0.3 pad 0.51)
  Top 0.254: R24.1 14.39,89.79 v14.1,89.79
  Bottom 0.203: 8.78,105.9 U6.5
  Bottom 0.254: v14.1,89.79 14.1,91.44 9.53,96.01 9.53,105.16 8.78,105.9
ATT2LA  (via drill 0.3 pad 0.51)
  Top 0.254: R32.1 20.95,103.72 v20.95,102.49
  Route15 0.254: v20.19,95.89 20.19,94.49 17.78,92.08 9.53,92.08 v8.13,93.47
  Bottom 0.203: U6.6 7.66,105.5 8.13,105.03
  Bottom 0.254: v20.95,102.49 20.95,96.65 v20.19,95.89 | v8.13,93.47 8.13,105.03
ATT2LB  (via drill 0.3 pad 0.51)
  Top 0.254: v27.94,96.39 27.05,97.28 27.05,101.13 R33.1
  Route15 0.254: v27.94,96.39 23.37,96.39 18.29,91.31 v8.38,91.31
  Bottom 0.203: U6.7 7.11,105.07 7.11,92.58
  Bottom 0.254: v8.38,91.31 7.11,92.58
ATT2RA  (via drill 0.3 pad 0.51)
  Top 0.254: R45.1 14.26,115.32 v14.1,115.32 | v4.19,114.43 3.43,114.43 2.92,113.92 2.92,110.62 3.94,109.6 3.94,108.71 2.67,107.44 2.67,104.52 4.57,102.62 5.84,102.62 v6.22,103
  Route15 0.254: v14.1,115.32 11.05,115.32 10.16,114.43 v4.19,114.43
  Bottom 0.203: 6.28,103.05 U6.8
  Bottom 0.254: v6.22,103 6.28,103.05
ATT2RB  (via drill 0.3 pad 0.51)
  Top 0.254: R46.1 20.03,115.32 v20.19,115.32 | v3.56,113.67 3.56,110.74 4.45,109.86 4.45,108.46 3.3,107.31 3.3,104.78 4.7,103.38 v5.46,103.38
  Route15 0.254: v20.19,115.32 19.56,114.68 11.3,114.68 10.29,113.67 v3.56,113.67
  Bottom 0.203: U6.9 5.88,103.8 v5.46,103.38
ATT3LA  (via drill 0.3 pad 0.51)
  Top 0.254: R56.1 35.69,101.43 35.69,102.11 37.08,103.5 v37.08,107.95
  Bottom 0.203: 36.23,107.1 U13.2
  Bottom 0.254: v37.08,107.95 36.23,107.1
ATT3LB  (via drill 0.3 pad 0.51)
  Top 0.254: R57.1 42.42,101.39 v42.42,102.74
  Bottom 0.203: 36.59,106.7 U13.3
  Bottom 0.254: 36.59,106.7 37.08,107.19 39.24,107.19 42.42,104.01 v42.42,102.74
ATT3RA  (via drill 0.3 pad 0.51)
  Top 0.254: R59.1 48.48,89.79 v48.77,89.79
  Bottom 0.203: 37.47,106.3 U13.4
  Bottom 0.254: v48.77,89.79 47.75,88.77 45.97,88.77 38.86,95.89 38.86,104.9 37.47,106.3
ATT3RB  (via drill 0.3 pad 0.51)
  Top 0.254: R60.1 42.97,89.79 v42.67,89.79
  Bottom 0.203: 36.98,105.9 U13.5
  Bottom 0.254: v42.67,89.79 42.67,91.06 38.23,95.5 38.23,104.65 36.98,105.9
ATT4LA  (via drill 0.3 pad 0.51)
  Top 0.254: R62.1 49.53,103.72 v49.53,102.49
  Route15 0.254: v48.77,95.89 48.77,94.49 46.35,92.08 38.1,92.08 v36.7,93.47
  Bottom 0.203: U13.6 36.23,105.5 36.7,105.03
  Bottom 0.254: v49.53,102.49 49.53,96.65 v48.77,95.89 | v36.7,93.47 36.7,105.03
ATT4LB  (via drill 0.3 pad 0.51)
  Top 0.254: R63.1 56.52,103.72 56.52,100.08 v53.59,97.16
  Route15 0.254: v53.59,97.16 52.7,97.16 46.86,91.31 v36.96,91.31
  Bottom 0.203: U13.7 35.69,105.07 35.69,92.58
  Bottom 0.254: v36.96,91.31 35.69,92.58
ATT4RA  (via drill 0.3 pad 0.51)
  Top 0.254: R65.1 42.84,115.32 v42.67,115.32 | v34.8,103 34.85,103.05 34.85,103.76 34.09,104.52 32.77,104.52 32.13,105.16 32.13,107.44 34.16,109.47 34.16,109.98 34.54,110.36 35.31,110.36 35.69,109.98 v37.97,109.98
  Bottom 0.203: 34.85,103.05 U13.8
  Bottom 0.254: v34.8,103 34.85,103.05 | v42.67,115.32 37.97,110.62 v37.97,109.98
ATT4RB  (via drill 0.3 pad 0.51)
  Top 0.254: R66.1 48.6,115.32 v48.77,115.32 | v32.13,113.67 32.13,110.11 32.64,109.6 32.64,108.58 31.62,107.57 31.62,105.03 33.27,103.38 v34.04,103.38
  Route15 0.254: v48.77,115.32 47.12,113.67 36.2,113.67 35.56,114.3 32.77,114.3 v32.13,113.67
  Bottom 0.203: U13.9 34.45,103.8 v34.04,103.38
BCK
  Top 0.254: U1.2 13.86,68.21 10.16,64.52 10.16,58.08 R36.1
BCK_CONN
  Top 0.254: J1.9L R36.2
D3V3  (1 unrouted)
  Top 0.254: J1.7R 57.78,62.23 58.29,61.72 58.29,52.58 57.78,52.07 J1.11R J1.12R
D3V3CLK  (via drill 0.3 pad 0.51)
  Top 0.254: R4.2 22.95,36.87 v22.48,37.34 | v15.88,36.58 15.88,36.67 U4.4
  Route15 0.254: v22.48,37.34 16.64,37.34 v15.88,36.58
  pour Top (isolate 0.254, no thermals): 13.72,42.67 13.72,36.2 18.03,36.2 18.03,38.35 17.65,38.73 17.65,40.77 17.4,40.77 15.49,42.67
D3V3DAC  (via drill 0.3 pad 0.51)
  Top 0.254: v26.92,51.69 27.94,51.69 28.01,51.69 U9.5 | U8.5 31.88,51.76 v31.88,53.09
  Top 0.61: C22.1 36.19,51.8 36.47,51.8 | 36.47,51.8 v36.45,51.82 | U10.5 36.47,51.8 | 25.4,51.69 27.94,51.69 28.07,51.69
  Route15 0.254: v2.67,108.58 2.92,108.33 v7.11,108.33 7.75,108.97 12.19,108.97 16.38,113.16 19.05,113.16 22.86,109.35 27.43,109.35 28.19,108.58 v31.24,108.58 31.5,108.33 v35.69,108.33 | v31.88,53.09 31.62,53.34 31.11,53.34
  Bottom 0.203: 2.95,108.3 U6.22 | 7.08,108.3 U6.1 | 31.53,108.3 U13.22 | 35.66,108.3 U13.1
  Bottom 0.254: 2.95,108.3 v2.67,108.58 2.16,108.08 2.16,104.39 3.05,103.5 3.05,93.34 10.29,86.11 10.29,83.82 17.14,76.83 20.07,76.83 v21.59,75.18 | v7.11,108.33 7.08,108.3 | v31.24,108.58 31.53,108.3 | v35.69,108.33 35.66,108.3
  other vias: 21.59,74.42 21.59,73.66 26.92,52.58 26.16,52.58 27.69,52.58
  pour Top (isolate 0.254, no thermals): 21.39,69.01 21.39,75.62 22.5,75.62 22.5,71.3 21.87,69.9 21.87,69.01
  pour Top (isolate 0.254, no thermals): 24.51,78.23 21.46,78.23 21.46,75.82 21.59,75.56 22.61,75.56 22.61,76.33 23.37,77.09 24.51,77.09
  pour Route15 (isolate 0.254, no thermals): 21.97,78.23 21.97,72.9 18.8,72.9 16.13,70.23 16.13,44.58 17.78,43.05 17.91,42.93 19.94,42.93 19.94,47.62 26.67,54.36 41.27,54.36 41.27,50.8 29.97,50.8 24.51,45.34 24.51,39.12 23.5,38.1 13.59,38.1 9.53,42.16 9.53,68.58 19.18,78.23
  pour Top (isolate 0.254, no thermals): 24.64,51.82 28.45,51.82 28.45,53.09 24.64,53.09
D7VU  (via drill 0.51 pad 0.81)
  Top 0.61: U4.1 13.27,39.43 13.59,39.12 13.59,37.85 13.27,37.53 U4.3
  Bottom 0.254: v8.13,33.02 8.26,32.89 8.26,26.67
  Bottom 1.93: J1.21L 8.26,26.67 J1.21R
  other vias: 8.13,34.04 9.14,34.04 9.14,33.02 10.16,33.02 11.18,33.02 12.19,33.02 12.19,34.04 11.18,34.04 10.16,34.04
  pour Top (isolate 0.254, no thermals): 12.83,37.59 12.83,32.51 7.62,32.51 7.62,37.59
  pour Bottom (isolate 0.254, no thermals): 7.37,34.54 7.37,26.16 13.21,26.16 13.21,34.54
DGND  (via drill 0.51 pad 0.81)
  Top 0.61: U5.2 18.29,39.12 19.18,38.23 19.18,37.12 C21.2 20.45,35.77 20.45,34.8 25.4,34.8 25.78,35.18 R5.1
  other vias: 41.53,48.39 41.53,49.4 40.51,49.4 40.51,48.39 40.51,50.42 41.53,50.42 25.02,47.37 26.04,47.37 25.02,48.39 26.04,48.39 14.35,35.18 15.37,35.18 16.38,35.18 17.4,35.18 14.35,34.16 15.37,34.16 16.38,34.16 17.4,34.16 11.05,38.61 11.05,39.62 9.91,40.26
  pour Top (isolate 0.406, no thermals): 15.37,43.43 12.95,43.43 12.95,38.35 8.76,38.35 8.76,45.09 15.37,45.09
  pour Top (isolate 0.254, no thermals): 18.54,37.72 18.54,35.69 13.72,35.69 13.72,32.51 21.34,32.51 21.34,37.72
  pour Top (isolate 0.254, no thermals): 24.64,50.93 44.32,50.93 44.32,48.01 27.18,48.01 27.18,46.74 24.64,46.74
  pour Bottom (isolate 0.254, no thermals): 8.13,61.34 0.13,61.34 0.13,27.81 6.6,27.81 6.6,35.43 13.84,35.43 13.84,27.94 60.83,27.94 60.83,60.83 39.24,60.83 39.24,33.53 18.29,33.53 18.29,40.64 8.13,40.64
  pour Bottom (isolate 0.254, no thermals): 27.18,50.55 23.37,50.55 23.37,33.15 27.18,33.15
HWCON
  Top 0.254: J1.9R 53.72,57.15 51.44,54.86 51.44,48.26 49.4,46.23 38.48,46.23 | 38.48,46.23 29.08,46.23 28.98,46.33 U9.2 | U10.2 38.48,49.1 38.48,46.23
LRCK
  Top 0.254: U1.3 14.37,67.71 11.18,64.52 11.18,54.01 R37.1
LRCK_CONN
  Top 0.254: J1.11L R37.2
MCLK  (via drill 0.3 pad 0.51)
  Top 0.254: R6.1 v17.27,48.39 | v17.65,69.22 18.15,68.71 U1.1
  Bottom 0.254: v17.27,48.39 17.27,68.83 v17.65,69.22
MCLKN
  Top 0.254: J1.18R 54.99,34.29 54.1,33.4 52.96,33.4 44.83,41.53 25.87,41.53 C18.2
MCLKP
  Top 0.254: J1.19R 55.24,31.75 54.23,32.77 52.7,32.77 44.58,40.89 25.87,40.89 C17.2
MISO  (via drill 0.3 pad 0.51)
  Top 0.254: v35.94,109.22 35.69,109.22 34.92,108.46 34.92,107.95 35.56,107.31 35.56,102.87 v34.04,101.35
  Route15 0.254: v34.8,46.86 34.8,41.15 25.4,31.75 J1.19L
  Bottom 0.203: U13.28 34.85,108.64 35.43,109.22 v35.94,109.22
  Bottom 0.254: v34.04,101.35 33.91,101.22 33.91,92.08 36.96,89.03 39.5,89.03 44.2,84.33 44.2,56.26 v34.8,46.86
MOSI  (via drill 0.3 pad 0.51)
  Top 0.254: v19.3,60.58 19.3,61.59 | 19.3,61.59 19.88,62.17 U1.13 | J1.18L 5.97,34.29 7.37,35.69 7.37,39.37 v8.64,40.64 | v6.35,109.47 6.35,108.08 6.86,107.57 6.86,102.74 5.71,101.6 v2.29,101.6 | v13.46,68.83 v13.46,79.5 | v15.62,61.72 19.18,61.72 19.3,61.59
  Bottom 0.203: U6.27 5.88,109 v6.35,109.47
  Bottom 0.254: v19.3,60.58 19.3,45.21 20.32,44.2 20.32,43.43 19.81,42.93 10.92,42.93 v8.64,40.64 | v2.29,101.6 2.29,92.96 9.53,85.72 9.53,83.44 v13.46,79.5 | v13.46,68.83 13.46,63.88 v15.62,61.72
N$1  (via drill 0.3 pad 0.51)
  Top 0.254: U8.2 32.89,49.05 v32.89,48.01 | v39.37,52.96 39.37,51.84 U10.4
  Bottom 0.254: v32.89,48.01 32.89,51.56 34.29,52.96 v39.37,52.96
N$2
  Top 0.406: 10.41,92.46 R10.1 | R12.1 10.41,92.46 | 10.41,92.46 R7.1 | 10.41,92.46 C23.1
N$3
  Top 0.406: R8.1 12.95,92.46 | 13.08,92.46 R11.1 | 12.95,92.46 13.08,92.46 | 12.95,92.46 C23.2 | 13.08,92.46 R9.2
N$4
  Top 0.305: U7.3 16.5,97.61 C24.1
  Top 0.406: C24.1 R9.1
N$5
  Top 0.305: U7.2 15.85,98.78 15.28,98.21 13.08,98.21 | R10.2 12.52,98.21 13.08,98.21 | C25.1 13.21,98.08 13.08,98.21
N$6
  Bottom 0.254: X1.3 16.26,124.95 R85.2
N$7
  Bottom 0.254: X1.7 20.19,124.95 R86.2
N$8  (via drill 0.3 pad 0.51)
  Top 0.254: R15.2 12.19,101.43 v12.19,102.74
  Top 0.305: R14.2 10.38,101.35 R13.2 10.45,101.35 R15.2
  Route15 0.254: v19.18,96.52 17.65,96.52 17.53,96.65 12.32,96.65 v11.81,96.14
  Bottom 0.254: U12.3 17.78,99.06 18.54,98.3 18.54,97.16 v19.18,96.52 | v11.81,96.14 11.81,102.36 v12.19,102.74
N$11
  Top 0.406: 38.99,92.46 R52.1 | R54.1 38.99,92.46 | 38.99,92.46 R49.1 | 38.99,92.46 C34.1
N$12
  Top 0.406: R50.1 41.53,92.46 | 41.66,92.46 R53.1 | 41.53,92.46 41.66,92.46 | 41.53,92.46 C34.2 | 41.66,92.46 R51.2
N$13
  Top 0.305: U14.3 45.07,97.61 C35.1
  Top 0.406: R51.1 C35.1
N$14
  Top 0.305: U14.2 44.42,98.78 43.85,98.21 41.66,98.21 | R52.2 41.1,98.21 41.66,98.21 | C40.1 41.78,98.08 41.66,98.21
N$15
  Bottom 0.254: X1.11 24.26,124.95 R87.2
N$16
  Top 0.254: R5.2 R4.1 23.62,40.35 C17.1 21.42,40.39 R3.2 19.24,40.3 U5.3
N$17
  Bottom 0.254: X1.15 26.8,123.56 R88.2
N$18  (via drill 0.3 pad 0.51)
  Top 0.254: R57.2 40.77,101.43 v40.77,102.74
  Top 0.305: R56.2 38.95,101.35 R55.2 39.03,101.35 R57.2
  Route15 0.254: v47.75,96.52 46.23,96.52 46.1,96.65 40.89,96.65 v40.39,96.14
  Bottom 0.254: U15.3 46.35,99.6 46.35,99.06 47.12,98.3 47.12,97.16 v47.75,96.52 | v40.39,96.14 40.39,102.36 v40.77,102.74
N$20
  Top 0.254: C18.1 21.38,42.04 R3.1 19.24,42 U5.4
N$22  (via drill 0.3 pad 0.51)
  Top 0.254: R59.2 46.77,89.79 v46.74,89.79
  Top 0.305: R60.2 R58.2 R59.2
  Bottom 0.254: v46.74,89.79 43.94,92.58 43.94,97.79 45.07,98.92 U15.5
N$23
  Top 0.406: 21.34,92.46 R19.1 | R21.1 21.34,92.46 | 21.34,92.46 R16.1 | 21.34,92.46 C15.1
N$24
  Top 0.254: U5.5 17.34,45.31 R6.2
N$25
  Top 0.406: R17.1 23.88,92.46 | 24,92.46 R20.1 | 23.88,92.46 24,92.46 | 23.88,92.46 C15.2 | 24,92.46 R18.2
N$26
  Top 0.305: U7.5 17.8,100.6 18.54,101.35 21.59,101.35 24,98.93 R18.1
  Top 0.406: R18.1 C19.1
N$27
  Top 0.305: U7.6 18.45,100.23 18.92,100.71 21.21,100.71 21.46,100.46 21.46,98.72 C27.1 20.66,96.77 R19.2
N$28
  Bottom 0.254: X1.19 32.26,124.95 R89.2
N$29
  Bottom 0.254: X1.23 36.2,124.95 R90.2
N$30  (via drill 0.3 pad 0.51)
  Top 0.254: R23.2 18.2,89.79 v18.16,89.79
  Top 0.305: R24.2 R22.2 R23.2
  Bottom 0.254: v18.16,89.79 15.37,92.58 15.37,97.79 16.5,98.92 U12.5
N$31  (via drill 0.3 pad 0.51)
  Top 0.254: R63.2 54.74,103.72 v54.74,102.49
  Top 0.305: R62.2 52.92,103.76 R61.2 54.74,103.8 R63.2
  Route15 0.254: v43.43,108.33 v53.85,108.33
  Bottom 0.254: U15.10 45.09,105.38 45.09,105.92 44.58,106.43 44.58,107.19 v43.43,108.33 | v53.85,108.33 54.74,107.44 v54.74,102.49
N$32  (via drill 0.3 pad 0.51)
  Top 0.254: R66.2 46.9,115.32 v46.74,115.32
  Top 0.305: R65.2 R64.2 R66.2
  Bottom 0.254: v46.74,115.32 48.01,114.05 48.01,107.57 46.37,105.93 U15.12
N$33
  Top 0.406: R28.1 24,112.65 | 24,112.65 R30.1 | 24,112.65 R25.1 | 24,112.65 C28.1
N$34
  Top 0.406: 21.46,112.65 R26.1 | 21.34,112.65 R29.1 | 21.34,112.65 21.46,112.65 | 21.46,112.65 C28.2 | R27.2 21.34,112.65
N$35
  Top 0.305: U7.10 17.8,107.37 C29.1
  Top 0.406: C29.1 R27.1
N$36
  Top 0.305: U7.9 18.45,106.2 19.52,107.28 C30.1 22.27,107.28 R28.2
N$37
  Bottom 0.254: X1.27 40.26,124.95 R91.2
N$38
  Bottom 0.254: X1.31 44.2,124.95 R92.2
N$39  (via drill 0.3 pad 0.51)
  Top 0.254: v24.13,102.62 24.38,102.87 R31.2 24.46,103.72 R33.2
  Top 0.305: R31.2 24.34,103.76 R32.2 | R33.2 26.16,103.8
  Route15 0.254: v14.86,108.33 v25.27,108.33
  Bottom 0.254: U12.10 16.51,105.38 16.51,105.92 16,106.43 16,107.19 v14.86,108.33 | v25.27,108.33 24.13,107.19 v24.13,102.62
N$40
  Top 0.406: 49.91,92.46 R70.1 | 49.91,92.46 R72.1 | R67.1 49.91,92.46 | 49.91,92.46 C46.1
N$41
  Top 0.406: R68.1 52.45,92.46 | 52.58,92.46 R71.1 | 52.45,92.46 52.58,92.46 | 52.45,92.46 C46.2 | 52.58,92.46 R69.2
N$42
  Top 0.406: R41.1 12.95,112.65 | 12.95,112.65 R43.1 | 12.95,112.65 R34.1 | 12.95,112.65 C31.1
N$43
  Top 0.406: 10.41,112.65 R35.1 | 10.29,112.65 R42.1 | 10.29,112.65 10.41,112.65 | 10.41,112.65 C31.2 | R40.2 10.29,112.65
N$43B  (via drill 3.17 pad 6.35)
  other vias: 5.08,125.73
N$44
  Top 0.305: U7.12 16.5,104.38 15.88,103.76 14.35,103.76 10.29,107.82 R40.1
  Top 0.406: C32.1 R40.1
N$45
  Top 0.305: U7.13 15.85,104.62 15.62,104.39 14.61,104.39 14.35,104.65 14.35,106.08 C33.1 13.25,108.71 R41.2
N$45B  (via drill 3.17 pad 6.35)
  other vias: 55.88,125.73
N$46
  Top 0.305: U14.5 46.37,100.6 47.12,101.35 50.16,101.35 52.58,98.93 R69.1
  Top 0.406: R69.1 C47.1
N$47
  Top 0.305: U14.6 47.02,100.23 47.5,100.71 49.78,100.71 50.04,100.46 50.04,98.72 C48.1 49.24,96.77 R70.2
N$50  (via drill 0.3 pad 0.51)
  Top 0.254: R46.2 18.33,115.32 v18.16,115.32
  Top 0.305: R45.2 R44.2 R46.2
  Bottom 0.254: v18.16,115.32 19.43,114.05 19.43,107.57 17.8,105.93 U12.12
N$53
  Top 0.406: R76.1 52.58,112.65 | 52.58,112.65 R78.1 | 52.58,112.65 R73.1 | 52.58,112.65 C49.1
N$54
  Top 0.406: 50.04,112.65 R74.1 | 49.91,112.65 R77.1 | 49.91,112.65 50.04,112.65 | 50.04,112.65 C49.2 | R75.2 49.91,112.65
N$55
  Top 0.305: U14.10 46.37,107.37 C50.1
  Top 0.406: C50.1 R75.1
N$56
  Top 0.305: U14.9 47.02,106.2 48.09,107.28 C51.1 50.85,107.28 R76.2
N$59
  Top 0.406: R82.1 41.53,112.65 | 41.53,112.65 R84.1 | 41.53,112.65 R79.1 | 41.53,112.65 C52.1
N$60
  Top 0.406: 38.99,112.65 R80.1 | 38.86,112.65 R83.1 | 38.86,112.65 38.99,112.65 | 38.99,112.65 C52.2 | R81.2 38.86,112.65
N$61
  Top 0.305: U14.12 45.07,104.38 44.45,103.76 42.93,103.76 38.86,107.82 R81.1
  Top 0.406: C53.1 R81.1
N$62
  Top 0.305: U14.13 44.42,104.62 44.2,104.39 43.18,104.39 42.93,104.65 42.93,106.08 C54.1 41.82,108.71 R82.2
ON15V  (via drill 0.3 pad 0.51, 0.51 pad 0.81)
  other vias: 16.64,103 17.4,103 18.16,103 17.02,103.76 17.78,103.76 18.54,103.76 45.21,103 45.97,103 46.74,103 45.59,103.76 46.35,103.76 47.12,103.76 47.5,73.79 48.64,73.79 49.78,73.79 50.93,73.79 47.5,72.77 48.64,72.77 49.78,72.77 50.93,72.77 47.5,71.75 48.64,71.75 49.78,71.75 50.93,71.75
  pour Top (isolate 0.254, no thermals): 16.38,107.7 16.38,102.74 18.8,102.74 18.8,107.7
  pour Route15 (isolate 0.254, no thermals): 5.71,102.74 39.12,102.74 39.12,107.7 5.71,107.7
  pour Bottom (isolate 0.254, no thermals): 16.38,107.7 18.8,107.7 18.8,102.74 16.38,102.74
  pour Top (isolate 0.254, no thermals): 44.96,107.7 44.96,102.74 47.37,102.74 47.37,107.7
  pour Route15 (isolate 0.254, no thermals): 34.29,102.74 60.83,102.74 60.83,107.7 34.29,107.7
  pour Bottom (isolate 0.254, no thermals): 44.96,107.7 47.37,107.7 47.37,102.74 44.96,102.74
  pour Top (isolate 0.254, no thermals): 46.23,74.3 46.23,64.26 51.44,64.26 51.56,64.39 51.56,74.42 46.23,74.42
  pour Route15 (isolate 0.254, no thermals): 52.32,103 60.83,103 60.71,70.99 47.37,70.99 46.1,72.26 46.1,85.09 52.32,91.31
OP15V  (via drill 0.3 pad 0.51, 0.51 pad 0.81)
  other vias: 16,101.98 16.76,101.98 17.53,101.98 16,101.22 16.76,101.22 44.58,101.98 45.34,101.98 46.1,101.98 44.58,101.22 45.34,101.22 9.02,74.55 10.03,74.55 10.03,75.56 9.02,75.56 9.02,76.58 10.03,76.58 10.03,77.6 9.02,77.6 10.41,78.74 11.56,78.74 10.41,79.88
  pour Top (isolate 0.254, no thermals): 17.91,97.41 17.91,102.23 15.75,102.23 15.75,97.41
  pour Route15 (isolate 0.254, no thermals): 1.14,102.23 29.21,102.23 29.21,97.16 1.14,97.16
  pour Bottom (isolate 0.254, no thermals): 15.75,102.23 18.16,102.23 18.16,97.41 15.75,97.41
  pour Top (isolate 0.254, no thermals): 46.48,97.41 46.48,102.23 44.32,102.23 44.32,97.41
  pour Route15 (isolate 0.254, no thermals): 27.18,102.23 47.37,102.23 47.37,97.16 27.18,97.16
  pour Bottom (isolate 0.254, no thermals): 44.32,102.23 46.74,102.23 46.74,97.41 44.32,97.41
  pour Top (isolate 0.254, no thermals): 8.51,81.03 8.51,74.04 12.57,74.04 12.57,78.74 10.29,81.03
  pour Route15 (isolate 0.254, no thermals): 0.25,102.23 0.25,73.53 10.16,73.66 12.83,76.33 12.83,85.47 6.35,91.95 6.35,102.23
OUTL1  (via drill 0.3 pad 0.51)
  Top 0.254: 22.73,117.47 v22.61,117.6 22.1,118.11 v13.21,118.11
  Bottom 0.254: U12.2 U12.1 19.09,103.3 21.84,106.05 21.84,116.84 v22.61,117.6 | v13.21,118.11 13.21,120.02 14.39,121.2 R85.1
OUTL2
  Bottom 0.254: 15.79,105.36 U12.9 U12.8 15.2,105.96 13.97,107.19 13.97,112.52 22.64,121.2 R87.1
OUTL3  (via drill 0.3 pad 0.51)
  Top 0.254: v51.31,118.24 v38.86,118.24
  Bottom 0.254: U15.2 U15.1 47.67,103.3 50.42,106.05 50.42,114.43 51.31,115.32 v51.31,118.24 | v38.86,118.24 38.86,119.13 38.1,119.89 33.57,119.89 R89.1
OUTL4
  Bottom 0.254: 44.37,105.36 U15.9 U15.8 43.77,105.96 42.55,107.19 42.55,112.52 44.45,114.43 44.45,118.75 42,121.2 R91.1
OUTR1
  Bottom 0.254: U12.6 U12.7 15.2,100.63 14.86,100.97 14.86,104.52 13.08,106.3 13.08,112.9 14.99,114.81 14.99,117.98 18.2,121.2 R86.1
OUTR2
  Bottom 0.254: U12.13 U12.14 19.09,105.96 20.45,107.31 20.45,113.41 21.08,114.05 21.08,117.09 24.26,120.27 25.02,120.27 25.95,121.2 R88.1
OUTR3
  Bottom 0.254: U15.6 U15.7 43.77,100.63 43.43,100.97 43.43,104.52 41.66,106.3 41.66,112.9 43.56,114.81 43.56,115.82 38.19,121.2 R90.1
OUTR4
  Bottom 0.254: U15.13 U15.14 47.67,105.96 49.02,107.31 49.02,113.41 49.66,114.05 49.66,117.47 45.94,121.2 R92.1
SCLK  (via drill 0.3 pad 0.51)
  Top 0.254: J1.13R 53.34,46.99 51.44,45.09 v20.83,45.09 | v19.94,61.34 20.38,61.78 U1.14 | v10.16,119.51 v25.65,119.51
  Route15 0.254: v25.65,119.51 v31.88,119.51
  Bottom 0.203: U6.24 4.68,109.37 4.19,109.86 v2.16,109.86 | U13.24 33.26,109.37 32.77,109.86 v31.11,109.86
  Bottom 0.254: v20.83,45.09 20.83,58.17 19.94,59.05 v19.94,61.34 19.94,62.99 19.56,63.37 19.56,72.52 8.89,83.19 8.89,85.34 1.65,92.58 1.65,109.35 v2.16,109.86 2.16,118.62 4.45,120.9 8.76,120.9 v10.16,119.51 | v31.88,119.51 31.88,115.44 31.11,114.68 v31.11,109.86
SDATA0
  Top 0.254: U1.4 14.89,67.21 12.06,64.39 12.06,52.36 R38.1
SDATA0_CONN
  Top 0.254: J1.12L R38.2
SDATA1
  Top 0.254: U1.5 15.53,66.71 12.95,64.14 12.95,50.71 R39.1
SDATA1_CONN
  Top 0.254: J1.13L R39.2
SDATA2
  Top 0.254: U1.6 16.18,66.21 13.84,63.88 13.84,49.06 R1.1
SDATA2_CONN
  Top 0.254: R1.2 J1.14L
SDATA3
  Top 0.254: U1.7 16.82,65.71 14.73,63.63 14.73,47.41 R2.1
SDATA3_CONN
  Top 0.254: R2.2 J1.15L
SPI_DATA_INT  (via drill 0.3 pad 0.51)
  Route15 0.254: v7.24,109.35 7.49,109.6 11.81,109.6 15.88,113.67 v22.73,113.67 | v25.27,114.17 28.57,114.17 32.51,110.24 34.29,110.24 v34.92,109.6
  Bottom 0.203: 34.45,109.06 U13.27 34.45,109.13 v34.92,109.6 | U6.28 6.28,108.64 6.48,108.84 6.73,108.84 v7.24,109.35
  Bottom 0.254: v22.73,113.67 24.77,113.67 v25.27,114.17
VDD18
  Top 0.254: U1.47 20.38,69.86 19.07,71.17 18.95,71.17
  pour Top (isolate 0.254, no thermals): 17.42,71.81 18.31,71.81 19.96,70.15 17.42,70.15

## Text on the board
tPlace: 8-ch DAC (AK4458) | M. Price